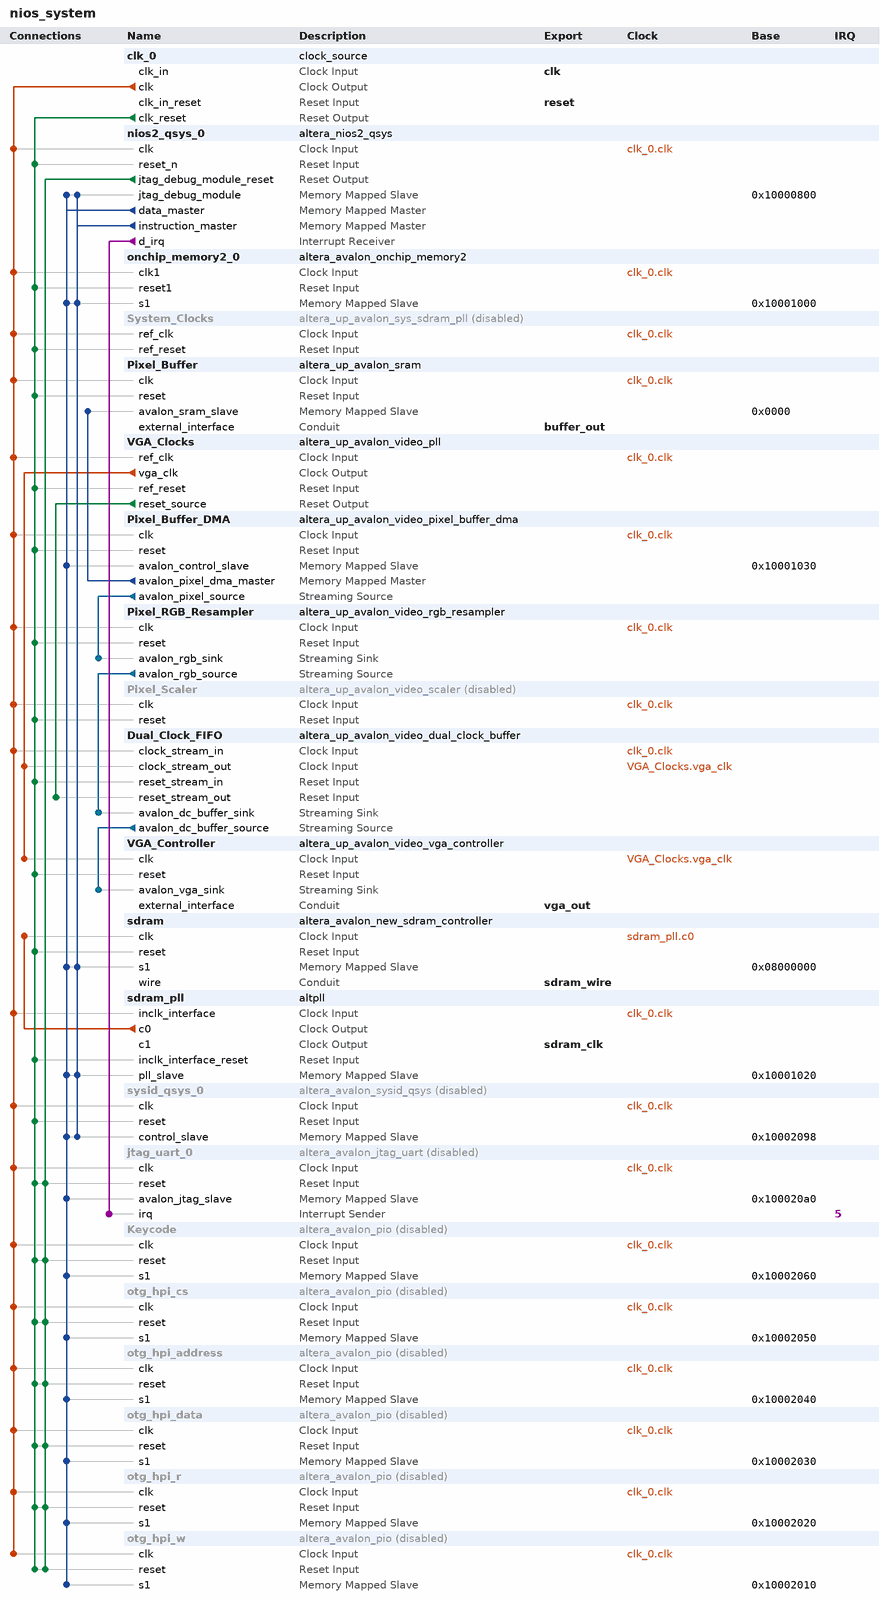
[diagram p0: system contents]
# Platform Designer (Qsys) system nios_system, Cyclone IV E EP4CE115F29C7
# Parameters at their usual value, and those the tool derives, are not listed.
package require -exact qsys 15.0
create_system nios_system
set_project_property DEVICE_FAMILY {Cyclone IV E}
set_project_property DEVICE EP4CE115F29C7

add_instance clk_0 clock_source 15.0
set_instance_parameter_value clk_0 clockFrequency 50000000

add_instance nios2_qsys_0 altera_nios2_qsys 15.0
set_instance_parameter_value nios2_qsys_0 breakSlave nios2_qsys_0.jtag_debug_module
set_instance_parameter_value nios2_qsys_0 exceptionSlave sdram.s1
set_instance_parameter_value nios2_qsys_0 icache_size 4096
set_instance_parameter_value nios2_qsys_0 impl Tiny
set_instance_parameter_value nios2_qsys_0 mmu_TLBMissExcSlave None
set_instance_parameter_value nios2_qsys_0 resetSlave sdram.s1
set_instance_parameter_value nios2_qsys_0 resetrequest_enabled true

add_instance onchip_memory2_0 altera_avalon_onchip_memory2 15.0
set_instance_parameter_value onchip_memory2_0 dataWidth 32
set_instance_parameter_value onchip_memory2_0 dualPort false
set_instance_parameter_value onchip_memory2_0 initMemContent true
set_instance_parameter_value onchip_memory2_0 initializationFileName onchip_mem.hex
set_instance_parameter_value onchip_memory2_0 memorySize 16

add_instance System_Clocks altera_up_avalon_sys_sdram_pll 15.0
set_instance_property System_Clocks ENABLED false
set_instance_parameter_value System_Clocks CV_boards DE1-SoC
set_instance_parameter_value System_Clocks gui_outclk 50.0
set_instance_parameter_value System_Clocks gui_refclk 50.0

add_instance Pixel_Buffer altera_up_avalon_sram 15.0
set_instance_parameter_value Pixel_Buffer board DE2-115
set_instance_parameter_value Pixel_Buffer pixel_buffer false

add_instance VGA_Clocks altera_up_avalon_video_pll 15.0
set_instance_parameter_value VGA_Clocks camera {5MP Digital Camera}
set_instance_parameter_value VGA_Clocks gui_refclk 50.0
set_instance_parameter_value VGA_Clocks lcd {7" LCD on VEEK-MT and MTL Module}

add_instance Pixel_Buffer_DMA altera_up_avalon_video_pixel_buffer_dma 15.0
set_instance_parameter_value Pixel_Buffer_DMA addr_mode Consecutive
set_instance_parameter_value Pixel_Buffer_DMA back_start_address 311296
set_instance_parameter_value Pixel_Buffer_DMA color_space {16-bit RGB}
set_instance_parameter_value Pixel_Buffer_DMA image_height 480
set_instance_parameter_value Pixel_Buffer_DMA image_width 640
set_instance_parameter_value Pixel_Buffer_DMA start_address 0

add_instance Pixel_RGB_Resampler altera_up_avalon_video_rgb_resampler 15.0
set_instance_parameter_value Pixel_RGB_Resampler alpha 1023
set_instance_parameter_value Pixel_RGB_Resampler input_type {16-bit RGB}
set_instance_parameter_value Pixel_RGB_Resampler output_type {30-bit RGB}

add_instance Pixel_Scaler altera_up_avalon_video_scaler 15.0
set_instance_property Pixel_Scaler ENABLED false
set_instance_parameter_value Pixel_Scaler color_bits 10
set_instance_parameter_value Pixel_Scaler color_planes 3
set_instance_parameter_value Pixel_Scaler height_in 480
set_instance_parameter_value Pixel_Scaler height_scaling 1
set_instance_parameter_value Pixel_Scaler width_in 640
set_instance_parameter_value Pixel_Scaler width_scaling 1

add_instance Dual_Clock_FIFO altera_up_avalon_video_dual_clock_buffer 15.0
set_instance_parameter_value Dual_Clock_FIFO color_bits 10

add_instance VGA_Controller altera_up_avalon_video_vga_controller 15.0
set_instance_parameter_value VGA_Controller board DE2-115
set_instance_parameter_value VGA_Controller resolution {VGA 640x480}

add_instance sdram altera_avalon_new_sdram_controller 15.0
set_instance_parameter_value sdram TAC 5.5
set_instance_parameter_value sdram TRCD 20.0
set_instance_parameter_value sdram TRP 20.0
set_instance_parameter_value sdram casLatency 3
set_instance_parameter_value sdram columnWidth 10
set_instance_parameter_value sdram dataWidth 32
set_instance_parameter_value sdram generateSimulationModel false
set_instance_parameter_value sdram model single_Micron_MT48LC4M32B2_7_chip
set_instance_parameter_value sdram numberOfBanks 4
set_instance_parameter_value sdram numberOfChipSelects 1
set_instance_parameter_value sdram powerUpDelay 200.0
set_instance_parameter_value sdram refreshPeriod 7.8125
set_instance_parameter_value sdram rowWidth 13

add_instance sdram_pll altpll 15.0
set_instance_parameter_value sdram_pll CLK0_DIVIDE_BY 1
set_instance_parameter_value sdram_pll CLK0_MULTIPLY_BY 1
set_instance_parameter_value sdram_pll CLK1_DIVIDE_BY 1
set_instance_parameter_value sdram_pll CLK1_DUTY_CYCLE 50
set_instance_parameter_value sdram_pll CLK1_MULTIPLY_BY 1
set_instance_parameter_value sdram_pll CLK1_PHASE_SHIFT -3000
set_instance_parameter_value sdram_pll INCLK0_INPUT_FREQUENCY 20000
set_instance_parameter_value sdram_pll PORT_ARESET PORT_UNUSED
set_instance_parameter_value sdram_pll PORT_LOCKED PORT_UNUSED
set_instance_parameter_value sdram_pll PORT_clk1 PORT_USED
set_instance_parameter_value sdram_pll PORT_clk2 PORT_UNUSED
set_instance_parameter_value sdram_pll PORT_clk3 PORT_UNUSED

add_instance sysid_qsys_0 altera_avalon_sysid_qsys 15.0
set_instance_property sysid_qsys_0 ENABLED false
set_instance_parameter_value sysid_qsys_0 id 0

add_instance jtag_uart_0 altera_avalon_jtag_uart 15.0
set_instance_property jtag_uart_0 ENABLED false
set_instance_parameter_value jtag_uart_0 simInteractiveOptions NO_INTERACTIVE_WINDOWS

add_instance Keycode altera_avalon_pio 15.0
set_instance_property Keycode ENABLED false
set_instance_parameter_value Keycode direction Output
set_instance_parameter_value Keycode width 16

add_instance otg_hpi_cs altera_avalon_pio 15.0
set_instance_property otg_hpi_cs ENABLED false
set_instance_parameter_value otg_hpi_cs direction Output
set_instance_parameter_value otg_hpi_cs width 1

add_instance otg_hpi_address altera_avalon_pio 15.0
set_instance_property otg_hpi_address ENABLED false
set_instance_parameter_value otg_hpi_address direction Output
set_instance_parameter_value otg_hpi_address width 2

add_instance otg_hpi_data altera_avalon_pio 15.0
set_instance_property otg_hpi_data ENABLED false
set_instance_parameter_value otg_hpi_data direction InOut
set_instance_parameter_value otg_hpi_data width 16

add_instance otg_hpi_r altera_avalon_pio 15.0
set_instance_property otg_hpi_r ENABLED false
set_instance_parameter_value otg_hpi_r direction Output
set_instance_parameter_value otg_hpi_r width 1

add_instance otg_hpi_w altera_avalon_pio 15.0
set_instance_property otg_hpi_w ENABLED false
set_instance_parameter_value otg_hpi_w direction Output
set_instance_parameter_value otg_hpi_w width 1

# connections
add_connection clk_0.clk Dual_Clock_FIFO.clock_stream_in clock
add_connection clk_0.clk jtag_uart_0.clk clock
add_connection clk_0.clk Keycode.clk clock
add_connection clk_0.clk nios2_qsys_0.clk clock
add_connection clk_0.clk onchip_memory2_0.clk1 clock
add_connection clk_0.clk otg_hpi_address.clk clock
add_connection clk_0.clk otg_hpi_cs.clk clock
add_connection clk_0.clk otg_hpi_data.clk clock
add_connection clk_0.clk otg_hpi_r.clk clock
add_connection clk_0.clk otg_hpi_w.clk clock
add_connection clk_0.clk Pixel_Buffer.clk clock
add_connection clk_0.clk Pixel_Buffer_DMA.clk clock
add_connection clk_0.clk Pixel_RGB_Resampler.clk clock
add_connection clk_0.clk Pixel_Scaler.clk clock
add_connection clk_0.clk sdram_pll.inclk_interface clock
add_connection clk_0.clk sysid_qsys_0.clk clock
add_connection clk_0.clk System_Clocks.ref_clk clock
add_connection clk_0.clk VGA_Clocks.ref_clk clock
add_connection sdram_pll.c0 sdram.clk clock
add_connection VGA_Clocks.vga_clk Dual_Clock_FIFO.clock_stream_out clock
add_connection VGA_Clocks.vga_clk VGA_Controller.clk clock
add_connection clk_0.clk_reset Dual_Clock_FIFO.reset_stream_in reset
add_connection clk_0.clk_reset jtag_uart_0.reset reset
add_connection clk_0.clk_reset Keycode.reset reset
add_connection clk_0.clk_reset nios2_qsys_0.reset_n reset
add_connection clk_0.clk_reset onchip_memory2_0.reset1 reset
add_connection clk_0.clk_reset otg_hpi_address.reset reset
add_connection clk_0.clk_reset otg_hpi_cs.reset reset
add_connection clk_0.clk_reset otg_hpi_data.reset reset
add_connection clk_0.clk_reset otg_hpi_r.reset reset
add_connection clk_0.clk_reset otg_hpi_w.reset reset
add_connection clk_0.clk_reset Pixel_Buffer.reset reset
add_connection clk_0.clk_reset Pixel_Buffer_DMA.reset reset
add_connection clk_0.clk_reset Pixel_RGB_Resampler.reset reset
add_connection clk_0.clk_reset Pixel_Scaler.reset reset
add_connection clk_0.clk_reset sdram.reset reset
add_connection clk_0.clk_reset sdram_pll.inclk_interface_reset reset
add_connection clk_0.clk_reset sysid_qsys_0.reset reset
add_connection clk_0.clk_reset System_Clocks.ref_reset reset
add_connection clk_0.clk_reset VGA_Clocks.ref_reset reset
add_connection clk_0.clk_reset VGA_Controller.reset reset
add_connection nios2_qsys_0.jtag_debug_module_reset jtag_uart_0.reset reset
add_connection nios2_qsys_0.jtag_debug_module_reset Keycode.reset reset
add_connection nios2_qsys_0.jtag_debug_module_reset otg_hpi_address.reset reset
add_connection nios2_qsys_0.jtag_debug_module_reset otg_hpi_cs.reset reset
add_connection nios2_qsys_0.jtag_debug_module_reset otg_hpi_data.reset reset
add_connection nios2_qsys_0.jtag_debug_module_reset otg_hpi_r.reset reset
add_connection nios2_qsys_0.jtag_debug_module_reset otg_hpi_w.reset reset
add_connection VGA_Clocks.reset_source Dual_Clock_FIFO.reset_stream_out reset
add_connection nios2_qsys_0.data_master jtag_uart_0.avalon_jtag_slave avalon
set_connection_parameter_value nios2_qsys_0.data_master/jtag_uart_0.avalon_jtag_slave baseAddress 0x100020a0
add_connection nios2_qsys_0.data_master Keycode.s1 avalon
set_connection_parameter_value nios2_qsys_0.data_master/Keycode.s1 baseAddress 0x10002060
add_connection nios2_qsys_0.data_master nios2_qsys_0.jtag_debug_module avalon
set_connection_parameter_value nios2_qsys_0.data_master/nios2_qsys_0.jtag_debug_module baseAddress 0x10000800
add_connection nios2_qsys_0.data_master onchip_memory2_0.s1 avalon
set_connection_parameter_value nios2_qsys_0.data_master/onchip_memory2_0.s1 baseAddress 0x10001000
add_connection nios2_qsys_0.data_master otg_hpi_address.s1 avalon
set_connection_parameter_value nios2_qsys_0.data_master/otg_hpi_address.s1 baseAddress 0x10002040
add_connection nios2_qsys_0.data_master otg_hpi_cs.s1 avalon
set_connection_parameter_value nios2_qsys_0.data_master/otg_hpi_cs.s1 baseAddress 0x10002050
add_connection nios2_qsys_0.data_master otg_hpi_data.s1 avalon
set_connection_parameter_value nios2_qsys_0.data_master/otg_hpi_data.s1 baseAddress 0x10002030
add_connection nios2_qsys_0.data_master otg_hpi_r.s1 avalon
set_connection_parameter_value nios2_qsys_0.data_master/otg_hpi_r.s1 baseAddress 0x10002020
add_connection nios2_qsys_0.data_master otg_hpi_w.s1 avalon
set_connection_parameter_value nios2_qsys_0.data_master/otg_hpi_w.s1 baseAddress 0x10002010
add_connection nios2_qsys_0.data_master Pixel_Buffer_DMA.avalon_control_slave avalon
set_connection_parameter_value nios2_qsys_0.data_master/Pixel_Buffer_DMA.avalon_control_slave baseAddress 0x10001030
add_connection nios2_qsys_0.data_master sdram.s1 avalon
set_connection_parameter_value nios2_qsys_0.data_master/sdram.s1 baseAddress 0x08000000
add_connection nios2_qsys_0.data_master sdram_pll.pll_slave avalon
set_connection_parameter_value nios2_qsys_0.data_master/sdram_pll.pll_slave baseAddress 0x10001020
add_connection nios2_qsys_0.data_master sysid_qsys_0.control_slave avalon
set_connection_parameter_value nios2_qsys_0.data_master/sysid_qsys_0.control_slave baseAddress 0x10002098
add_connection nios2_qsys_0.instruction_master nios2_qsys_0.jtag_debug_module avalon
set_connection_parameter_value nios2_qsys_0.instruction_master/nios2_qsys_0.jtag_debug_module baseAddress 0x10000800
add_connection nios2_qsys_0.instruction_master onchip_memory2_0.s1 avalon
set_connection_parameter_value nios2_qsys_0.instruction_master/onchip_memory2_0.s1 baseAddress 0x10001000
add_connection nios2_qsys_0.instruction_master sdram.s1 avalon
set_connection_parameter_value nios2_qsys_0.instruction_master/sdram.s1 baseAddress 0x08000000
add_connection nios2_qsys_0.instruction_master sdram_pll.pll_slave avalon
set_connection_parameter_value nios2_qsys_0.instruction_master/sdram_pll.pll_slave baseAddress 0x10001020
add_connection nios2_qsys_0.instruction_master sysid_qsys_0.control_slave avalon
set_connection_parameter_value nios2_qsys_0.instruction_master/sysid_qsys_0.control_slave baseAddress 0x10002098
add_connection Pixel_Buffer_DMA.avalon_pixel_dma_master Pixel_Buffer.avalon_sram_slave avalon
set_connection_parameter_value Pixel_Buffer_DMA.avalon_pixel_dma_master/Pixel_Buffer.avalon_sram_slave baseAddress 0x0000
add_connection Dual_Clock_FIFO.avalon_dc_buffer_source VGA_Controller.avalon_vga_sink avalon_streaming
add_connection Pixel_Buffer_DMA.avalon_pixel_source Pixel_RGB_Resampler.avalon_rgb_sink avalon_streaming
add_connection Pixel_RGB_Resampler.avalon_rgb_source Dual_Clock_FIFO.avalon_dc_buffer_sink avalon_streaming
add_connection nios2_qsys_0.d_irq jtag_uart_0.irq interrupt
set_connection_parameter_value nios2_qsys_0.d_irq/jtag_uart_0.irq irqNumber 5

# exported interfaces
add_interface buffer_out conduit end
set_interface_property buffer_out EXPORT_OF Pixel_Buffer.external_interface
add_interface clk clock sink
set_interface_property clk EXPORT_OF clk_0.clk_in
add_interface reset reset sink
set_interface_property reset EXPORT_OF clk_0.clk_in_reset
add_interface sdram_clk clock source
set_interface_property sdram_clk EXPORT_OF sdram_pll.c1
add_interface sdram_wire conduit end
set_interface_property sdram_wire EXPORT_OF sdram.wire
add_interface vga_out conduit end
set_interface_property vga_out EXPORT_OF VGA_Controller.external_interface

set_interconnect_requirement {$system} qsys_mm.clockCrossingAdapter HANDSHAKE
set_interconnect_requirement {$system} qsys_mm.enableEccProtection FALSE
set_interconnect_requirement {$system} qsys_mm.insertDefaultSlave FALSE
set_interconnect_requirement {$system} qsys_mm.maxAdditionalLatency 1

save_system nios_system.qsys
